# EasyEDA Pro project 带有2个74HC595芯片级联的8位共阳数码管模块.eprj

# Schematic Schematic1
Board Name: Board1; Create Date: 2024-07-12
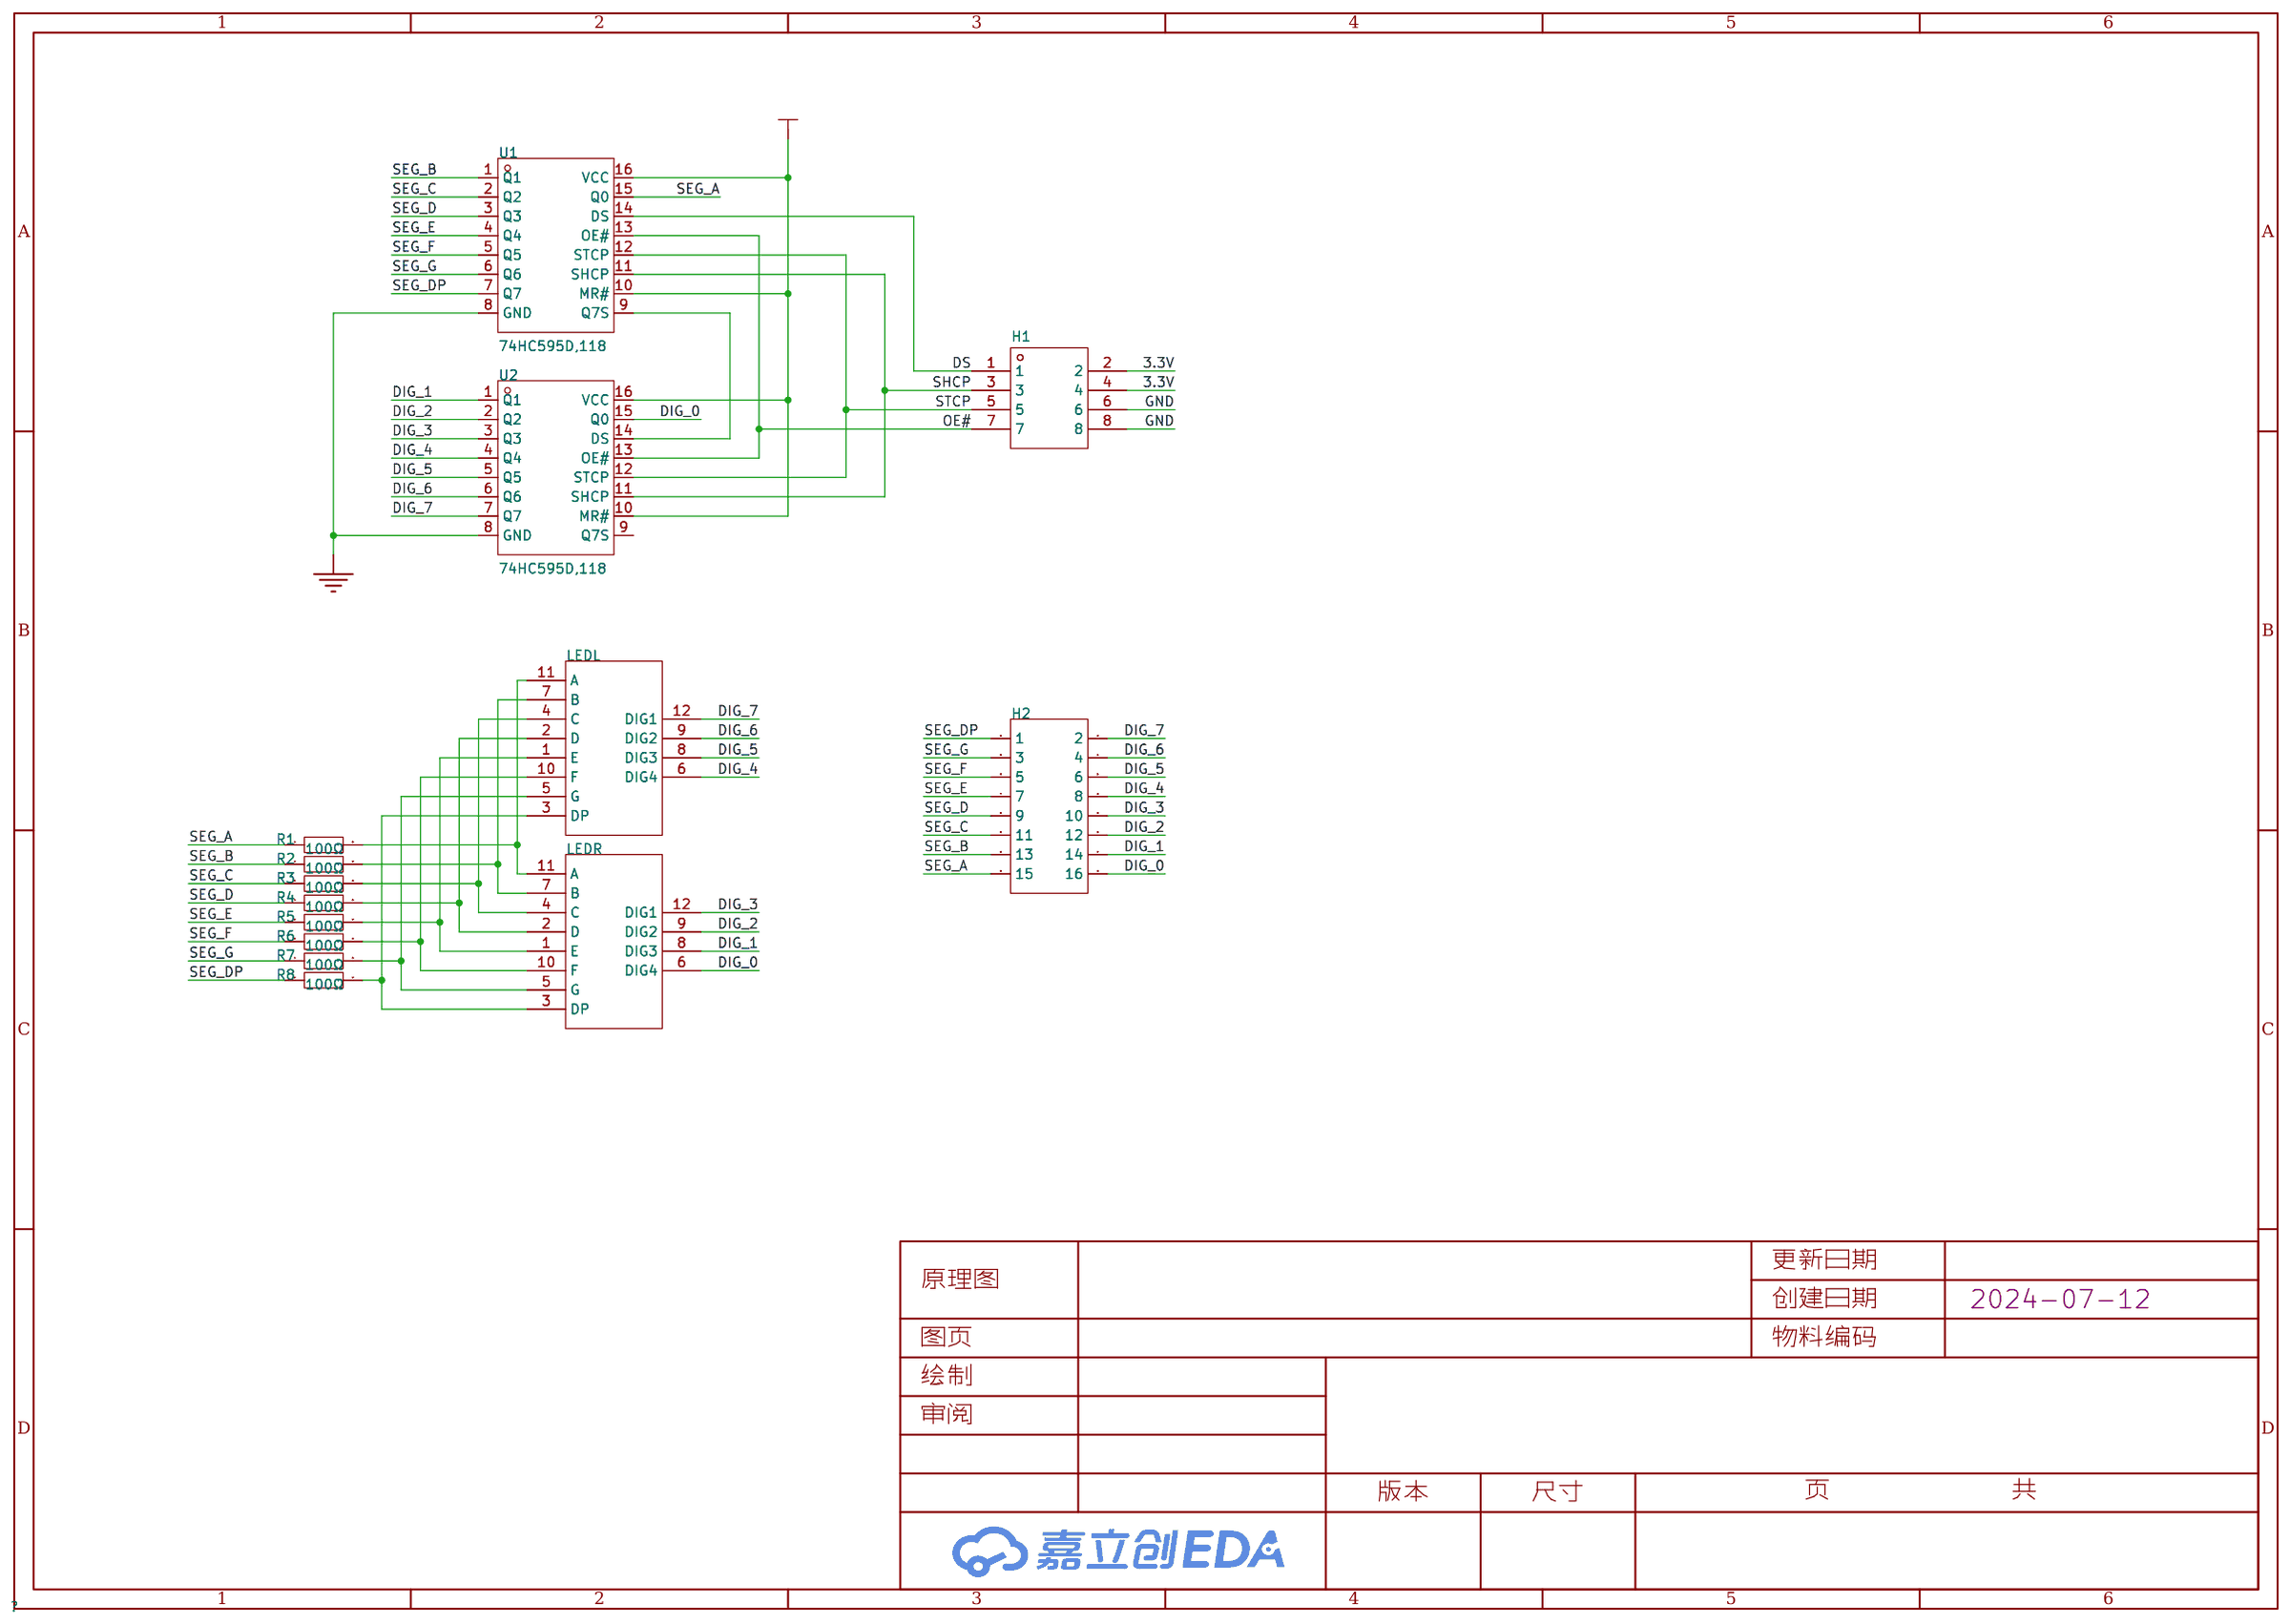
[diagram p0: schematic sheet]

## Parts
H1  -  [HDR-TH_8P-P2.54-V-M-R2-C4-S2.54]
H2  -  [HDR-TH_16P-P2.54-V-M-R2-C8-S2.54]
LEDL  3461BS  [0.36inch_4bits_7seg_CA]
LEDR  3461BS  [0.36inch_4bits_7seg_CA]
R1  100Ω  [Res_1/4W]
R2  100Ω  [Res_1/4W]
R3  100Ω  [Res_1/4W]
R4  100Ω  [Res_1/4W]
R5  100Ω  [Res_1/4W]
R6  100Ω  [Res_1/4W]
R7  100Ω  [Res_1/4W]
R8  100Ω  [Res_1/4W]
U1  74HC595D,118  [SOIC-16_L9.9-W3.9-P1.27-LS6.0-BL]
U2  74HC595D,118  [SOIC-16_L9.9-W3.9-P1.27-LS6.0-BL]

## Library data of the parts
H1 = HDR-M_2.54_2x4: Supplier Part: C124386; Supplier Footprint: 插件,P=2.54mm
H2 = HDR-M_2.54_2x8: Supplier Part: C68234; Supplier Footprint: 插件,P=2.54mm
LEDL LEDR = 0.36inch_4bits_7seg_CA
R1-R8 = Res_AXIAL-1/4W: Supplier Footprint: 轴向引线
U1 U2 = 74HC595D,118: LCSC Part Name: 三态输出 串行至串行或并行移位寄存器; Supplier Part: C5947; Manufacturer: Nexperia(安世); Supplier Footprint: SOIC-16; JLCPCB Part Class: 基础库; Datasheet: https://atta.szlcsc.com/upload/public/pdf/source/20140108/1457706668762.pdf; Supplier: LCSC; Function: 串行至串行或并行; Supply Voltage: 2V~6V; Number of Elements: 1; Number of Bits per Element: 8; Output Type: 三态; Series: 74HC; Operating Temperature: -40℃~+125℃

## Nets
3.3V: H1.2 H1.4 U1.10(MR#) U1.16(VCC) U2.10(MR#) U2.16(VCC)
GND: H1.6 H1.8 U1.8(GND) U2.8(GND)
DIG_0: H2.16 LEDR.6(DIG4) U2.15(Q0)
DIG_1: H2.14 LEDR.8(DIG3) U2.1(Q1)
DIG_2: H2.12 LEDR.9(DIG2) U2.2(Q2)
DIG_3: H2.10 LEDR.12(DIG1) U2.3(Q3)
DIG_4: H2.8 LEDL.6(DIG4) U2.4(Q4)
DIG_5: H2.6 LEDL.8(DIG3) U2.5(Q5)
DIG_6: H2.4 LEDL.9(DIG2) U2.6(Q6)
DIG_7: H2.2 LEDL.12(DIG1) U2.7(Q7)
DS: H1.1 U1.14(DS)
OE#: H1.7 U1.13(OE#) U2.13(OE#)
SEG_A: H2.15 R1.1 U1.15(Q0)
SEG_B: H2.13 R2.1 U1.1(Q1)
SEG_C: H2.11 R3.1 U1.2(Q2)
SEG_D: H2.9 R4.1 U1.3(Q3)
SEG_DP: H2.1 R8.1 U1.7(Q7)
SEG_E: H2.7 R5.1 U1.4(Q4)
SEG_F: H2.5 R6.1 U1.5(Q5)
SEG_G: H2.3 R7.1 U1.6(Q6)
SHCP: H1.3 U1.11(SHCP) U2.11(SHCP)
STCP: H1.5 U1.12(STCP) U2.12(STCP)
$1N266: U1.9(Q7S) U2.14(DS)
$1N1025: LEDL.11(A) LEDR.11(A) R1.2
$1N1028: LEDL.3(DP) LEDR.3(DP) R8.2
$1N1031: LEDL.5(G) LEDR.5(G) R7.2
$1N1034: LEDL.10(F) LEDR.10(F) R6.2
$1N1037: LEDL.1(E) LEDR.1(E) R5.2
$1N1040: LEDL.2(D) LEDR.2(D) R4.2
$1N1043: LEDL.4(C) LEDR.4(C) R3.2
$1N1046: LEDL.7(B) LEDR.7(B) R2.2

Not connected (* = marked no-connect by the designer): U2 9(Q7S)

# Board PCB1
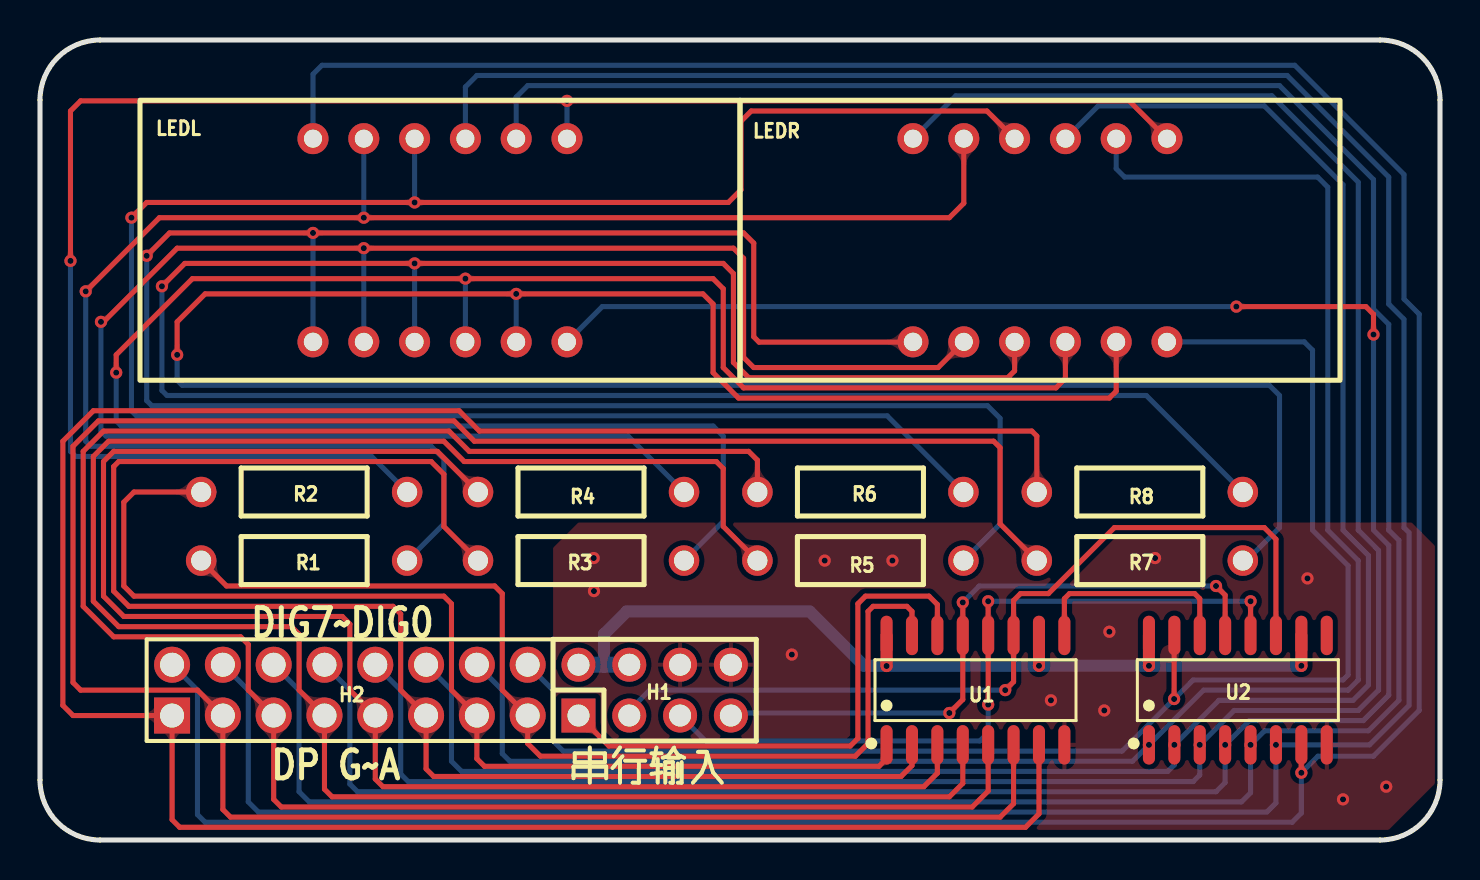
[diagram p1: board, top side]
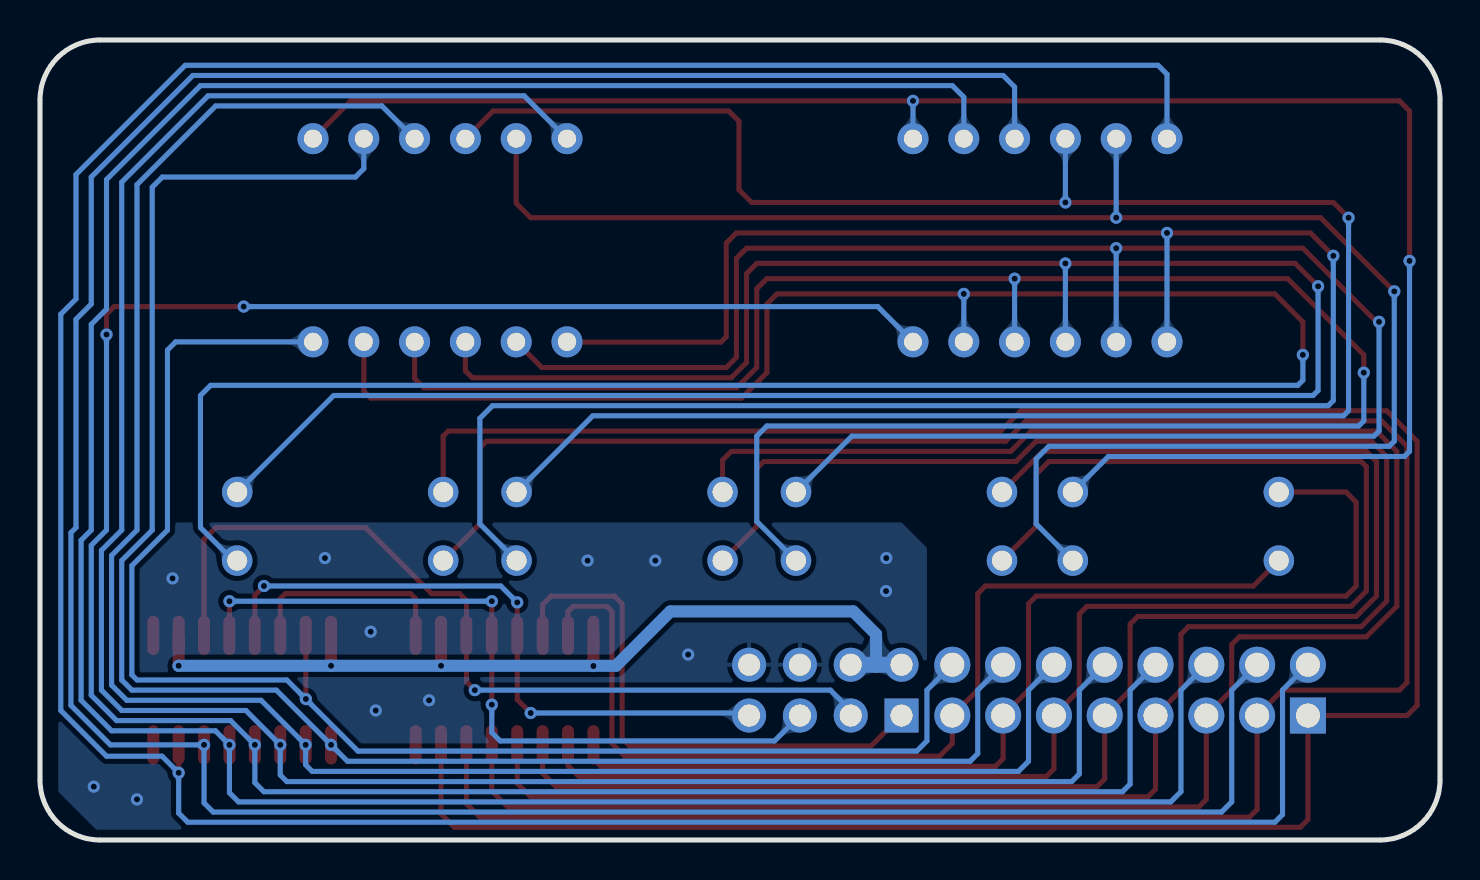
[diagram p2: board, bottom side, seen from below]

Outline 70 x 40 mm; copper layers: Top Layer, Bottom Layer. Coordinates in mm from the lower left corner of the outline.
Outline path: 0,37 0,3 arc(0.88,0.88) 3,0 67,0 arc(69.12,0.88) 70,3 70,37 arc(69.12,39.12) 67,40 3,40 arc(0.88,39.12) 0,37
Stack: Top Layer 0.035mm / Dielectric1 1.51mm FR4 er 4.5 / Bottom Layer 0.035mm

## Design rules (mm)
template: JLCPCB Capability(Two Layers Board)
spacing copperThickness1oz (default): track to track 0.102, other pairs 0.152 to 0.3
spacing copperThickness2oz: track to track 0.203, other pairs 0.152 to 0.3
track width copperThickness1oz (default): min 0.127, default 0.254, max 2.54
track width copperThickness2oz: min 0.203, default 0.254, max 2.54
differential pair differentialPair (default): width min 0.127, default 0.254, max 2.54; gap min 0.152, default 0.152
via viaSize (default): diameter min 0.5, default 0.61, max 10; hole min 0.3, default 0.305, max 6.3

## Placement (name value [footprint] x y rotation side)
H1  -  [HDR-TH_8P-P2.54-V-M-R2-C4-S2.54]  30.73 7.49 0 top
H2  -  [HDR-TH_16P-P2.54-V-M-R2-C8-S2.54]  15.49 7.49 0 top
LEDL  3461BS  [0.36inch_4bits_7seg_CA]  5 22.99 0 top
LEDR  3461BS  [0.36inch_4bits_7seg_CA]  35 22.99 0 top
R1  100Ω  [Res_1/4W]  13.21 13.97 0 top
R2  100Ω  [Res_1/4W]  13.21 17.4 0 top
R3  100Ω  [Res_1/4W]  27.05 13.97 0 top
R4  100Ω  [Res_1/4W]  27.05 17.4 0 top
R5  100Ω  [Res_1/4W]  41.02 13.97 0 top
R6  100Ω  [Res_1/4W]  41.02 17.4 0 top
R7  100Ω  [Res_1/4W]  54.99 13.97 0 top
R8  100Ω  [Res_1/4W]  54.99 17.4 0 top
U1  74HC595D,118  [SOIC-16_L9.9-W3.9-P1.27-LS6.0-BL]  46.77 7.49 0 top
U2  74HC595D,118  [SOIC-16_L9.9-W3.9-P1.27-LS6.0-BL]  59.89 7.49 0 top

## Footprints (pads in the part's own frame, mm; a bottom-side part is the same pattern mirrored in y, then rotated)
0.36inch_4bits_7seg_CA
  round 1.55 hole 0.914x0.9: 1(8.65,1.92)
  round 1.55 hole 0.9: 2(11.19,1.92) 3(13.73,1.92) 4(16.27,1.92) 5(18.81,1.92) 6(21.35,1.92) 7(21.35,12.08) 8(18.81,12.08) 9(16.27,12.08) 10(13.73,12.08) 11(11.19,12.08) 12(8.65,12.08)
HDR-TH_8P-P2.54-V-M-R2-C4-S2.54
  rect 1.7x1.7 hole 1.1: 1(-3.81,-1.27)
  round 1.7 hole 1.1: 2(-3.81,1.27) 3(-1.27,-1.27) 4(-1.27,1.27) 5(1.27,-1.27) 6(1.27,1.27) 7(3.81,-1.27) 8(3.81,1.27)
HDR-TH_16P-P2.54-V-M-R2-C8-S2.54
  rect 1.8x1.8 hole 1.2: 1(-8.89,-1.27)
  round 1.8 hole 1.2: 2(-8.89,1.27) 3(-6.35,-1.27) 4(-6.35,1.27) 5(-3.81,-1.27) 6(-3.81,1.27) 7(-1.27,-1.27) 8(-1.27,1.27) 9(1.27,-1.27) 10(1.27,1.27) 11(3.81,-1.27) 12(3.81,1.27) 13(6.35,-1.27) 14(6.35,1.27) 15(8.89,-1.27) 16(8.89,1.27)
Res_1/4W
  round 1.524 hole 1: 1(-5.15,0) 2(5.15,0)
SOIC-16_L9.9-W3.9-P1.27-LS6.0-BL
  oval 0.602x1.971 smd: 1(-4.445,-2.736) 2(-3.175,-2.736) 3(-1.905,-2.736) 4(-0.635,-2.736) 5(0.635,-2.736) 6(1.905,-2.736) 7(3.175,-2.736) 8(4.445,-2.736) 9(4.445,2.736) 10(3.175,2.736) 11(1.905,2.736) 12(0.635,2.736) 13(-0.635,2.736) 14(-1.905,2.736) 15(-3.175,2.736) 16(-4.445,2.736)

## Nets
As in the schematic.

Pads without a net: U2 9

## Via types
v1: diameter 0.61, hole 0.305, Top Layer to Bottom Layer, 49 vias

## Routing (per net, layer and track width the routed paths; a pad name or vN(x,y) marks a point on that pad's centre or on a via; arc(x,y) is an arc through that point)
3.3V: length 46.6
  Top Layer w0.6: U2.10 63.07,8.71 ; U2.16 v1(55.45,8.71) ; U1.16 v1(42.33,8.7) ; U1.10 v1(49.95,8.71)
  Bottom Layer w0.6: 28.2,8.76 28.2,10.29 29.34,11.43 38.48,11.43 41.2,8.71 v1(49.95,8.71) v1(55.45,8.71) v1(63.07,8.71)
  Bottom Layer w0.8: 26.92,8.76 29.46,8.76
GND:
  vias: v1(27.69,14.1) v1(27.7,12.45) v1(37.59,9.27) v1(39.24,13.97) v1(42.62,13.97) v1(50.55,6.98) v1(53.21,6.48) v1(53.47,10.41) v1(55.75,14.1) v1(63.37,13.08) v1(65.15,2.03) v1(67.31,2.67)
DIG_0: length 73.5
  Top Layer w0.254: v1(56.71,7.05) 56.71,10.22 U2.15
  Bottom Layer w0.254: LEDR.6 63.21,24.91 63.63,24.49 63.63,15.49 65.41,13.72 65.41,8.25 65.15,8 57.66,8 v1(56.71,7.05) 54.1,4.44 26.16,4.44 25.65,4.95 25.65,7.49 24.38,8.76
DIG_1: length 87.3
  Bottom Layer w0.254: 21.84,8.76 23.11,7.49 23.11,4.32 23.5,3.94 54.63,3.94 v1(55.45,4.76) 58.18,7.49 65.41,7.49 65.91,8 65.91,13.97 64.39,15.49 64.39,32.64 63.88,33.15 54.23,33.15 53.81,33.57 LEDR.8
DIG_2: length 95.5
  Bottom Layer w0.254: 19.3,8.76 20.57,7.49 20.57,3.94 21.08,3.43 56.39,3.43 56.72,3.76 v1(56.72,4.76) 58.94,6.98 65.66,6.98 66.42,7.75 66.42,14.22 65.15,15.49 65.15,32.77 61.21,36.7 52.91,36.7 LEDR.9
DIG_3: length 108.6
  Bottom Layer w0.254: LEDR.12 45.79,37.21 61.59,37.21 65.91,32.89 65.91,15.49 66.93,14.48 66.93,7.49 65.91,6.48 59.71,6.48 v1(57.99,4.76) 57.99,3.25 57.66,2.92 18.41,2.92 18.03,3.3 18.03,7.49 16.76,8.76
DIG_4: length 122.3
  Top Layer w0.254: v1(66.68,25.27) 66.68,26.29 66.29,26.67 v1(59.82,26.67)
  Bottom Layer w0.254: v1(59.82,26.67) 28.11,26.67 LEDL.6 ; 14.22,8.76 15.49,7.49 15.49,2.79 15.88,2.41 58.8,2.41 59.26,2.87 v1(59.26,4.76) 60.47,5.97 66.17,5.97 67.44,7.24 67.44,14.73 66.68,15.49 v1(66.68,25.27)
DIG_5: length 139.3
  Bottom Layer w0.254: LEDL.8 23.81,37.14 24.38,37.72 61.98,37.72 66.68,33.02 66.68,26.54 67.44,25.78 67.44,15.49 67.94,14.99 67.94,6.98 66.42,5.46 61.23,5.46 v1(60.53,4.76) 60.53,2.36 60.07,1.91 13.46,1.91 12.95,2.41 12.95,7.49 11.68,8.76
DIG_6: length 147.5
  Bottom Layer w0.254: 9.14,8.76 10.41,7.49 10.41,1.91 10.92,1.4 61.34,1.4 61.8,1.85 v1(61.8,4.76) 66.48,4.76 68.45,6.73 68.45,15.37 68.2,15.62 68.2,26.03 67.44,26.8 67.44,33.15 62.36,38.23 21.84,38.23 21.27,37.65 LEDL.9
DIG_7: length 161.5
  Top Layer w0.254: v1(63.07,3.36) U2.7
  Bottom Layer w0.254: LEDL.12 13.65,38.29 14.1,38.73 62.74,38.73 68.2,33.27 68.2,27.05 68.96,26.29 68.96,6.48 66.68,4.19 63.9,4.19 v1(63.07,3.36) 63.07,1.35 62.61,0.89 8.25,0.89 7.87,1.27 7.87,7.49 6.6,8.76
DS: length 27.3
  Top Layer w0.254: U1.14 44.87,11.77 44.45,12.19 41.28,12.19 40.89,11.81 40.89,5.08 40.51,4.7 28.45,4.7 H1.1
OE#: length 32.4
  Top Layer w0.254: U2.13 59.26,12.24 v1(58.8,12.7) ; v1(46.14,11.88) U1.13 46.14,7.02 v1(45.47,6.35)
  Bottom Layer w0.254: v1(46.14,11.88) 46.96,12.7 v1(58.8,12.7) ; H1.7 34.67,6.35 v1(45.47,6.35)
SEG_A: length 51.5
  Top Layer w0.254: U1.15 43.6,11.43 43.34,11.68 41.66,11.68 41.4,11.43 41.4,4.83 40.77,4.19 25.02,4.19 24.38,4.83 H2.15 23.11,7.49 23.11,12.32 22.73,12.7 9.33,12.7 R1.1
SEG_B: length 54.7
  Top Layer w0.254: 42.33,4.06 41.95,3.68 22.22,3.68 21.84,4.06 H2.13 20.57,7.49 20.57,11.81 20.19,12.19 4.7,12.19 4.19,12.7 4.19,16.89 4.7,17.4 8.69,17.4
SEG_C: length 76.9
  Top Layer w0.254: R3.1 20.19,15.68 20.19,18.29 19.56,18.92 3.94,18.92 3.68,18.67 3.68,12.45 4.44,11.68 17.65,11.68 18.03,11.3 18.03,7.49 H2.11 19.3,3.56 19.69,3.17 43.05,3.17 43.6,3.72 U1.2
SEG_D: length 77.6
  Top Layer w0.254: R4.1 19.87,19.43 3.68,19.43 3.17,18.92 3.17,12.19 4.19,11.18 15.11,11.18 15.49,10.8 15.49,7.49 H2.9 16.76,3.05 17.14,2.67 44.2,2.67 44.87,3.34 U1.3
SEG_DP: length 124
  Top Layer w0.254: U1.7 49.95,1.31 49.28,0.63 6.98,0.63 6.6,1.02 H2.1 1.65,6.22 1.14,6.73 1.14,19.94 2.67,21.46 20.96,21.46 21.97,20.45 49.59,20.45 49.84,20.2 R8.1
SEG_E: length 98.4
  Top Layer w0.254: U1.4 46.14,2.83 45.47,2.16 14.61,2.16 14.22,2.54 H2.7 12.95,7.49 12.95,10.29 12.57,10.67 3.94,10.67 2.67,11.94 2.67,19.18 3.43,19.94 20.19,19.94 21.21,18.92 33.82,18.92 34.16,18.58 34.16,15.68 35.87,13.97
SEG_F: length 99.9
  Top Layer w0.254: U1.5 47.41,2.45 46.61,1.65 12.06,1.65 11.68,2.03 H2.5 10.41,7.49 10.41,9.78 10.03,10.16 3.68,10.16 2.16,11.68 2.16,19.43 3.17,20.45 20.45,20.45 21.46,19.43 35.43,19.43 35.87,18.99 35.87,17.4
SEG_G: length 121.4
  Top Layer w0.254: R7.1 48.01,15.81 48.01,19.62 47.68,19.94 21.72,19.94 20.7,20.95 2.92,20.95 1.65,19.69 1.65,7.87 2.03,7.49 7.87,7.49 H2.3 9.14,1.52 9.53,1.14 48.01,1.14 48.68,1.82 U1.6
SHCP: length 43.8
  Top Layer w0.254: U2.11 61.8,15.04 61.21,15.62 53.72,15.62 50.42,12.32 49.02,12.32 48.68,11.98 U1.11 48.68,7.91 v1(48.26,7.49)
  Bottom Layer w0.254: H1.3 29.46,6.48 30.48,7.49 v1(48.26,7.49)
STCP: length 37.5
  Top Layer w0.254: v1(47.41,11.94) U1.12 v1(47.41,6.77) ; U2.12 v1(60.53,11.94)
  Bottom Layer w0.254: v1(47.41,11.94) v1(60.53,11.94) ; v1(47.41,6.77) 47.41,5.37 46.99,4.95 33.27,4.95 H1.5
$1N266: length 10.7
  Top Layer w0.254: U2.14 57.99,12.06 57.73,12.32 51.47,12.32 51.22,12.06 U1.9
$1N1025: length 84.5
  Top Layer w0.254: LEDR.11 46.19,31.84 45.47,31.11 v1(16.19,31.11) 5.97,31.11 v1(2.29,27.43)
  Bottom Layer w0.254: v1(16.19,31.11) LEDL.11 ; v1(2.29,27.43) 2.29,19.94 2.54,19.69 19.56,19.69 20.19,19.05 20.19,15.81 R1.2
$1N1028: length 114.9
  Top Layer w0.254: LEDR.3 48.73,23.46 48.39,23.11 35.43,23.11 34.67,23.88 34.67,28.32 34.16,28.83 v1(18.73,28.83) 7.24,28.83 v1(6.1,27.69)
  Bottom Layer w0.254: 60.14,17.4 55.31,22.22 6.35,22.22 6.1,22.48 v1(6.1,27.69) ; v1(18.73,28.83) LEDL.3
$1N1031: length 124.2
  Top Layer w0.254: LEDR.5 53.81,22.44 53.47,22.1 34.93,22.1 33.66,23.37 33.66,26.8 33.15,27.31 v1(23.81,27.31) 8.25,27.31 6.86,25.91 v1(6.86,24.26)
  Bottom Layer w0.254: v1(6.86,24.26) 6.86,22.99 7.11,22.73 61.47,22.73 61.98,22.22 61.98,15.62 60.32,13.97 60.14,13.97 ; v1(23.81,27.31) LEDL.5
$1N1034: length 105.1
  Top Layer w0.254: v1(4.57,31.11) 5.33,31.88 v1(18.73,31.88) 34.42,31.88 35.05,32.51 35.05,35.94 35.56,36.45 47.35,36.45 LEDR.10
  Bottom Layer w0.254: v1(4.57,31.11) 4.57,21.46 4.83,21.21 42.36,21.21 R6.2 ; v1(18.73,31.88) LEDL.10
$1N1037: length 107.4
  Top Layer w0.254: v1(5.33,29.21) 6.48,30.35 v1(13.65,30.35) 35.18,30.35 35.69,29.84 35.69,25.16 35.96,24.89 43.63,24.89 LEDR.1
  Bottom Layer w0.254: LEDL.1 v1(13.65,30.35) ; v1(5.33,29.21) 5.33,21.97 5.59,21.72 47.37,21.72 48.01,21.08 48.01,15.81 R5.2
$1N1040: length 91.1
  Top Layer w0.254: v1(3.05,25.91) 3.17,25.91 6.86,29.59 v1(16.19,29.59) 34.67,29.59 35.18,29.08 35.18,24.13 35.69,23.62 44.91,23.62 LEDR.2
  Bottom Layer w0.254: LEDL.2 v1(16.19,29.59) ; v1(3.05,25.91) 3.05,20.45 3.3,20.19 29.41,20.19 R4.2
$1N1043: length 99.8
  Top Layer w0.254: v1(3.81,23.37) 3.81,24.26 7.62,28.07 v1(21.27,28.07) 33.66,28.07 34.16,27.56 34.16,23.62 35.18,22.61 50.8,22.61 51.27,23.08 LEDR.4
  Bottom Layer w0.254: v1(3.81,23.37) 3.81,20.95 4.06,20.7 33.66,20.7 34.16,20.19 34.16,15.93 R3.2 ; LEDL.4 v1(21.27,28.07)
$1N1046: length 92.4
  Top Layer w0.254: LEDR.7 54.46,36.96 v1(26.35,36.96) 2.03,36.96 1.52,36.45 v1(1.52,28.96)
  Bottom Layer w0.254: R2.2 16.58,19.18 1.78,19.18 1.52,19.43 v1(1.52,28.96) ; LEDL.7 v1(26.35,36.96)

## Copper pours and planes (outline as drawn; the poured copper is in the pictures)
GND on Top Layer: 26.92,15.88 25.65,14.61 25.65,2.16 27.31,0.51 67.44,0.51 70.1,3.17 70.1,14.35 68.58,15.88
GND on Bottom Layer: 26.92,15.88 25.65,14.61 25.65,1.4 26.54,0.51 67.18,0.51 69.09,2.41 69.09,14.73 67.94,15.88

Small or netless copper shapes (teardrops, artwork), in the pictures only: 98 on Top Layer, 85 on Bottom Layer

## Text on the board
Top Silkscreen Layer: DIG7~DIG0 | DP G~A | 串行输入
